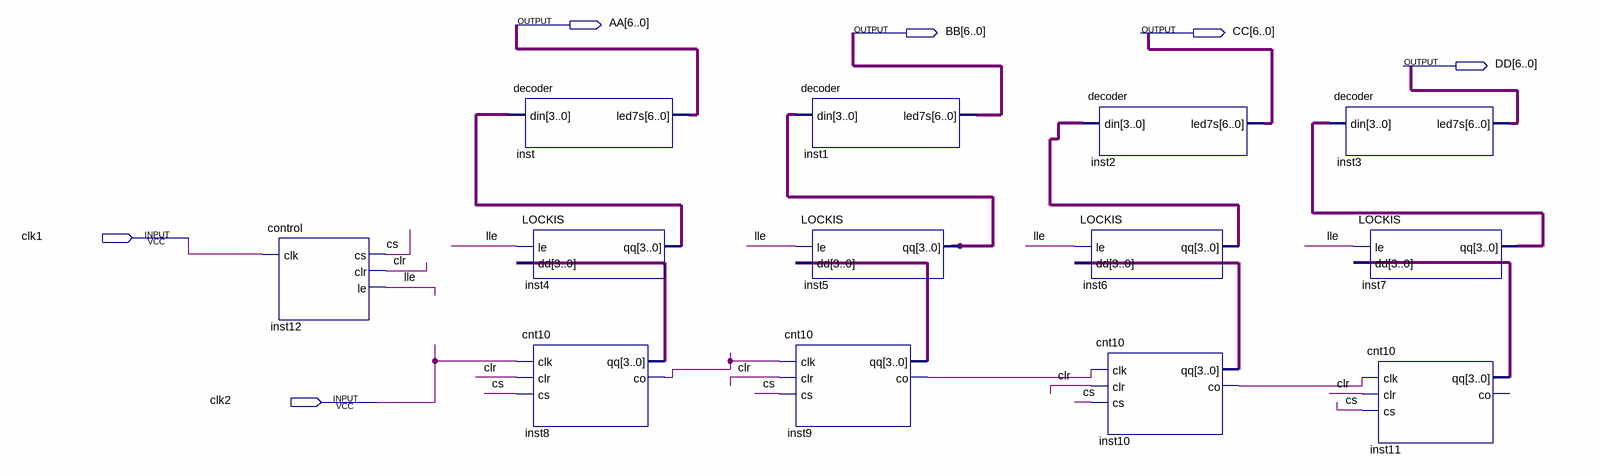
[diagram p0: schematic sheet]
// Quartus schematic all.bdf as structural Verilog: 13 symbols, 6 pins
module all (
  input  clk1,
  input  clk2,
  output [6:0] AA,
  output [6:0] BB,
  output [6:0] CC,
  output [6:0] DD
);

  wire clr, cs, inst8_co, inst9_co, inst10_co, lle;
  wire [3:0] inst4_qq, inst5_qq, inst6_qq, inst7_qq, inst8_qq, inst9_qq, inst10_qq, inst11_qq;
  wire [6:0] inst2_led7s, inst3_led7s;

  control inst12 (.clk(clk1), .cs(cs), .clr(clr), .le(lle));
  decoder inst (.din(inst4_qq), .led7s(AA));
  LOCKIS inst4 (.le(lle), .dd(inst8_qq), .qq(inst4_qq));
  cnt10 inst8 (.clk(clk2), .clr(clr), .cs(cs), .qq(inst8_qq), .co(inst8_co));
  decoder inst1 (.din(inst5_qq), .led7s(BB));
  LOCKIS inst5 (.le(lle), .dd(inst9_qq), .qq(inst5_qq));
  cnt10 inst9 (.clk(inst8_co), .clr(clr), .cs(cs), .qq(inst9_qq), .co(inst9_co));
  decoder inst2 (.din(inst6_qq), .led7s(inst2_led7s));
  LOCKIS inst6 (.le(lle), .dd(inst10_qq), .qq(inst6_qq));
  cnt10 inst10 (.clk(inst9_co), .clr(clr), .cs(cs), .qq(inst10_qq), .co(inst10_co));
  decoder inst3 (.din(inst7_qq), .led7s(inst3_led7s));
  LOCKIS inst7 (.le(lle), .dd(inst11_qq), .qq(inst7_qq));
  cnt10 inst11 (.clk(inst10_co), .clr(clr), .cs(cs), .qq(inst11_qq));  // open: co
endmodule
